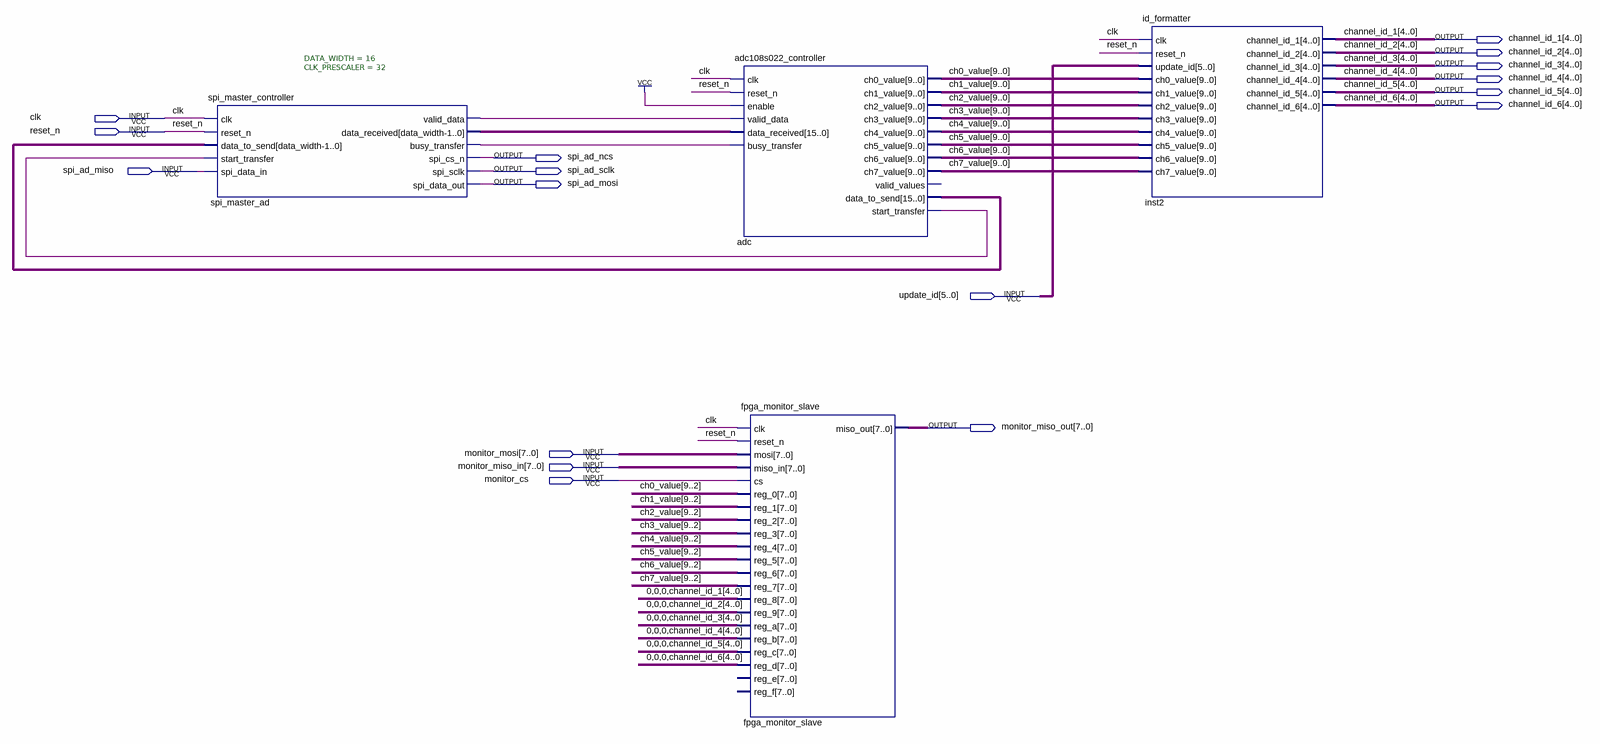
[diagram p0: schematic sheet]
// Quartus schematic id_reader.bdf as structural Verilog: 4 symbols, 17 pins
module id_reader (
  input  clk,
  input  reset_n,
  input  spi_ad_miso,
  input  [5:0] update_id,
  input  [7:0] monitor_mosi,
  input  [7:0] monitor_miso_in,
  input  monitor_cs,
  output [4:0] channel_id_1,
  output [4:0] channel_id_2,
  output [4:0] channel_id_3,
  output [4:0] channel_id_4,
  output [4:0] channel_id_5,
  output [4:0] channel_id_6,
  output spi_ad_ncs,
  output spi_ad_sclk,
  output spi_ad_mosi,
  output [7:0] monitor_miso_out
);

  wire \0 , adc_start_transfer, spi_master_ad_busy_transfer, spi_master_ad_valid_data;
  wire [9:0] ch0_value, ch1_value, ch2_value, ch3_value, ch4_value, ch5_value, ch6_value, ch7_value;
  wire [15:0] adc_data_to_send, spi_master_ad_data_received;

  spi_master_controller #(.DATA_WIDTH(16), .CLK_PRESCALER(32)) spi_master_ad (
    .clk(clk), .reset_n(reset_n), .data_to_send(adc_data_to_send), .start_transfer(adc_start_transfer),
    .spi_data_in(spi_ad_miso), .valid_data(spi_master_ad_valid_data),
    .data_received(spi_master_ad_data_received), .busy_transfer(spi_master_ad_busy_transfer),
    .spi_cs_n(spi_ad_ncs), .spi_sclk(spi_ad_sclk), .spi_data_out(spi_ad_mosi));
  adc108s022_controller adc (
    .clk(clk), .reset_n(reset_n), .enable(1'b1), .valid_data(spi_master_ad_valid_data),
    .data_received(spi_master_ad_data_received), .busy_transfer(spi_master_ad_busy_transfer),
    .ch0_value(ch0_value), .ch1_value(ch1_value), .ch2_value(ch2_value), .ch3_value(ch3_value),
    .ch4_value(ch4_value), .ch5_value(ch5_value), .ch6_value(ch6_value), .ch7_value(ch7_value),
    .data_to_send(adc_data_to_send), .start_transfer(adc_start_transfer));  // open: valid_values
  fpga_monitor_slave fpga_monitor_slave (
    .clk(clk), .reset_n(reset_n), .mosi(monitor_mosi), .miso_in(monitor_miso_in), .cs(monitor_cs),
    .reg_0(ch0_value[9:2]), .reg_1(ch1_value[9:2]), .reg_2(ch2_value[9:2]), .reg_3(ch3_value[9:2]),
    .reg_4(ch4_value[9:2]), .reg_5(ch5_value[9:2]), .reg_6(ch6_value[9:2]), .reg_7(ch7_value[9:2]),
    .reg_8({{3{\0 }}, channel_id_1}), .reg_9({{3{\0 }}, channel_id_2}), .reg_a({{3{\0 }}, channel_id_3}),
    .reg_b({{3{\0 }}, channel_id_4}), .reg_c({{3{\0 }}, channel_id_5}), .reg_d({{3{\0 }}, channel_id_6}),
    .miso_out(monitor_miso_out));  // open: reg_e, reg_f
  id_formatter inst2 (
    .clk(clk), .reset_n(reset_n), .update_id(update_id), .ch0_value(ch0_value), .ch1_value(ch1_value),
    .ch2_value(ch2_value), .ch3_value(ch3_value), .ch4_value(ch4_value), .ch5_value(ch5_value),
    .ch6_value(ch6_value), .ch7_value(ch7_value), .channel_id_1(channel_id_1), .channel_id_2(channel_id_2),
    .channel_id_3(channel_id_3), .channel_id_4(channel_id_4), .channel_id_5(channel_id_5),
    .channel_id_6(channel_id_6));
endmodule
